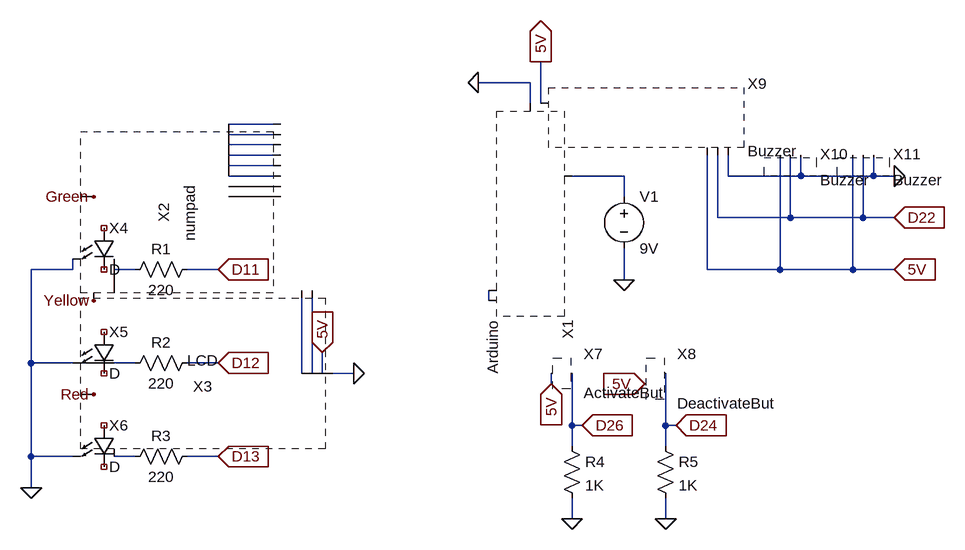
[diagram p0: schematic DBB2.asc]
DBB2.asc, the LTspice schematic file:
Version 4
SHEET 1 1208 884
WIRE 416 -112 336 -112
WIRE 416 -80 416 -112
WIRE 432 -80 432 -144
WIRE 32 -48 -48 -48
WIRE 32 -32 -48 -32
WIRE 32 -16 -48 -16
WIRE 32 0 -48 0
WIRE 32 16 -48 16
WIRE 32 32 -48 32
WIRE 560 32 480 32
WIRE 720 32 720 0
WIRE 832 32 832 0
WIRE 832 32 720 32
WIRE 944 32 944 0
WIRE 944 32 832 32
WIRE 976 32 944 32
WIRE 32 48 -48 48
WIRE 32 64 -48 64
WIRE 560 64 560 32
WIRE 704 96 704 0
WIRE 816 96 816 0
WIRE 816 96 704 96
WIRE 928 96 928 0
WIRE 928 96 816 96
WIRE 976 96 928 96
WIRE -288 176 -288 160
WIRE -288 176 -352 176
WIRE -224 176 -224 160
WIRE -192 176 -224 176
WIRE -64 176 -112 176
WIRE 688 176 688 0
WIRE 800 176 800 0
WIRE 800 176 688 176
WIRE 912 176 912 0
WIRE 912 176 800 176
WIRE 976 176 912 176
WIRE 560 192 560 144
WIRE 352 224 352 208
WIRE -352 320 -352 176
WIRE -288 320 -352 320
WIRE -192 320 -224 320
WIRE -64 320 -112 320
WIRE 64 336 64 208
WIRE 80 336 80 208
WIRE 96 336 96 304
WIRE 144 336 112 336
WIRE 448 352 448 336
WIRE 624 352 624 336
WIRE 480 416 480 336
WIRE 496 416 480 416
WIRE 624 416 624 352
WIRE 640 416 624 416
WIRE 480 448 480 416
WIRE 624 448 624 416
WIRE -352 464 -352 320
WIRE -288 464 -352 464
WIRE -192 464 -224 464
WIRE -64 464 -112 464
WIRE -352 512 -352 464
WIRE 480 560 480 528
WIRE 624 560 624 528
FLAG -352 512 0
FLAG -64 176 D11
IOPIN -64 176 In
FLAG -64 320 D12
IOPIN -64 320 In
FLAG -64 464 D13
IOPIN -64 464 In
FLAG 448 352 5V
IOPIN 448 352 In
FLAG 592 352 5V
IOPIN 592 352 In
FLAG 496 416 D26
IOPIN 496 416 In
FLAG 640 416 D24
IOPIN 640 416 In
FLAG 480 560 0
FLAG 624 560 0
FLAG 432 -144 5V
IOPIN 432 -144 Out
FLAG 336 -112 0
FLAG 976 32 0
FLAG 976 176 5V
IOPIN 976 176 In
FLAG 976 96 D22
IOPIN 976 96 In
FLAG 144 336 0
FLAG 96 304 5V
IOPIN 96 304 In
FLAG 560 192 0
FLAG -256 64 Green
FLAG -256 224 Yellow
FLAG -256 368 Red
SYMBOL Arduino 320 128 R90
SYMATTR InstName X1
SYMBOL LED -256 112 R0
SYMATTR InstName X4
SYMBOL LED -256 272 R0
SYMATTR InstName X5
SYMBOL LED -256 416 R0
SYMATTR InstName X6
SYMBOL res -96 160 R90
WINDOW 0 0 56 VBottom 2
WINDOW 3 32 56 VTop 2
SYMATTR InstName R1
SYMATTR Value 220
SYMBOL res -96 304 R90
WINDOW 0 0 56 VBottom 2
WINDOW 3 32 56 VTop 2
SYMATTR InstName R2
SYMATTR Value 220
SYMBOL res -96 448 R90
WINDOW 0 0 56 VBottom 2
WINDOW 3 32 56 VTop 2
SYMATTR InstName R3
SYMATTR Value 220
SYMBOL ActivateBut 464 288 R0
SYMATTR InstName X7
SYMBOL DeactivateBut 608 304 R0
SYMATTR InstName X8
SYMBOL res 464 432 R0
SYMATTR InstName R4
SYMATTR Value 1K
SYMBOL res 608 432 R0
SYMATTR InstName R5
SYMATTR Value 1K
SYMBOL Buzzer 704 -64 R0
SYMATTR InstName X9
SYMBOL Buzzer 816 -64 R0
SYMATTR InstName X10
SYMBOL Buzzer 928 -64 R0
SYMATTR InstName X11
SYMBOL numpad -80 16 R270
SYMATTR InstName X2
SYMBOL LCD 80 384 R180
SYMATTR InstName X3
SYMBOL voltage 560 48 R0
WINDOW 123 0 0 Left 0
WINDOW 39 0 0 Left 0
SYMATTR InstName V1
SYMATTR Value 9V

The netlist it stands for:
* DBB2.asc
* X1: Arduino (symbol Arduino not available, pin order unknown); nets seen at it: 0, N007, N011
D§X4 NC_01 NC_02 D
D§X5 NC_03 NC_04 D
D§X6 NC_05 NC_06 D
R1 D11 N010 220
R2 D12 N012 220
R3 D13 N015 220
* X7: ActivateBut (symbol ActivateBut not available, pin order unknown); nets seen at it: 5V, D26
* X8: DeactivateBut (symbol DeactivateBut not available, pin order unknown); nets seen at it: 5V, D24
R4 D26 0 1K
R5 D24 0 1K
* X9: Buzzer (symbol Buzzer not available, pin order unknown); nets seen at it: 0, 5V, D22
* X10: Buzzer (symbol Buzzer not available, pin order unknown); nets seen at it: 0, 5V, D22
* X11: Buzzer (symbol Buzzer not available, pin order unknown); nets seen at it: 0, 5V, D22
* X2: numpad (symbol numpad not available, pin order unknown); nets seen at it: 0, Green, N001, N002, N003, N004, N005, N006, N008, N009, N010, Yellow
* X3: LCD (symbol LCD not available, pin order unknown); nets seen at it: 0, 5V, N012, N013, N014, N015, Red
V1 N007 0 9V
.model D D
.lib standard.dio
.backanno
.end